# EAGLE design Register (EAGLE 9.6.2)
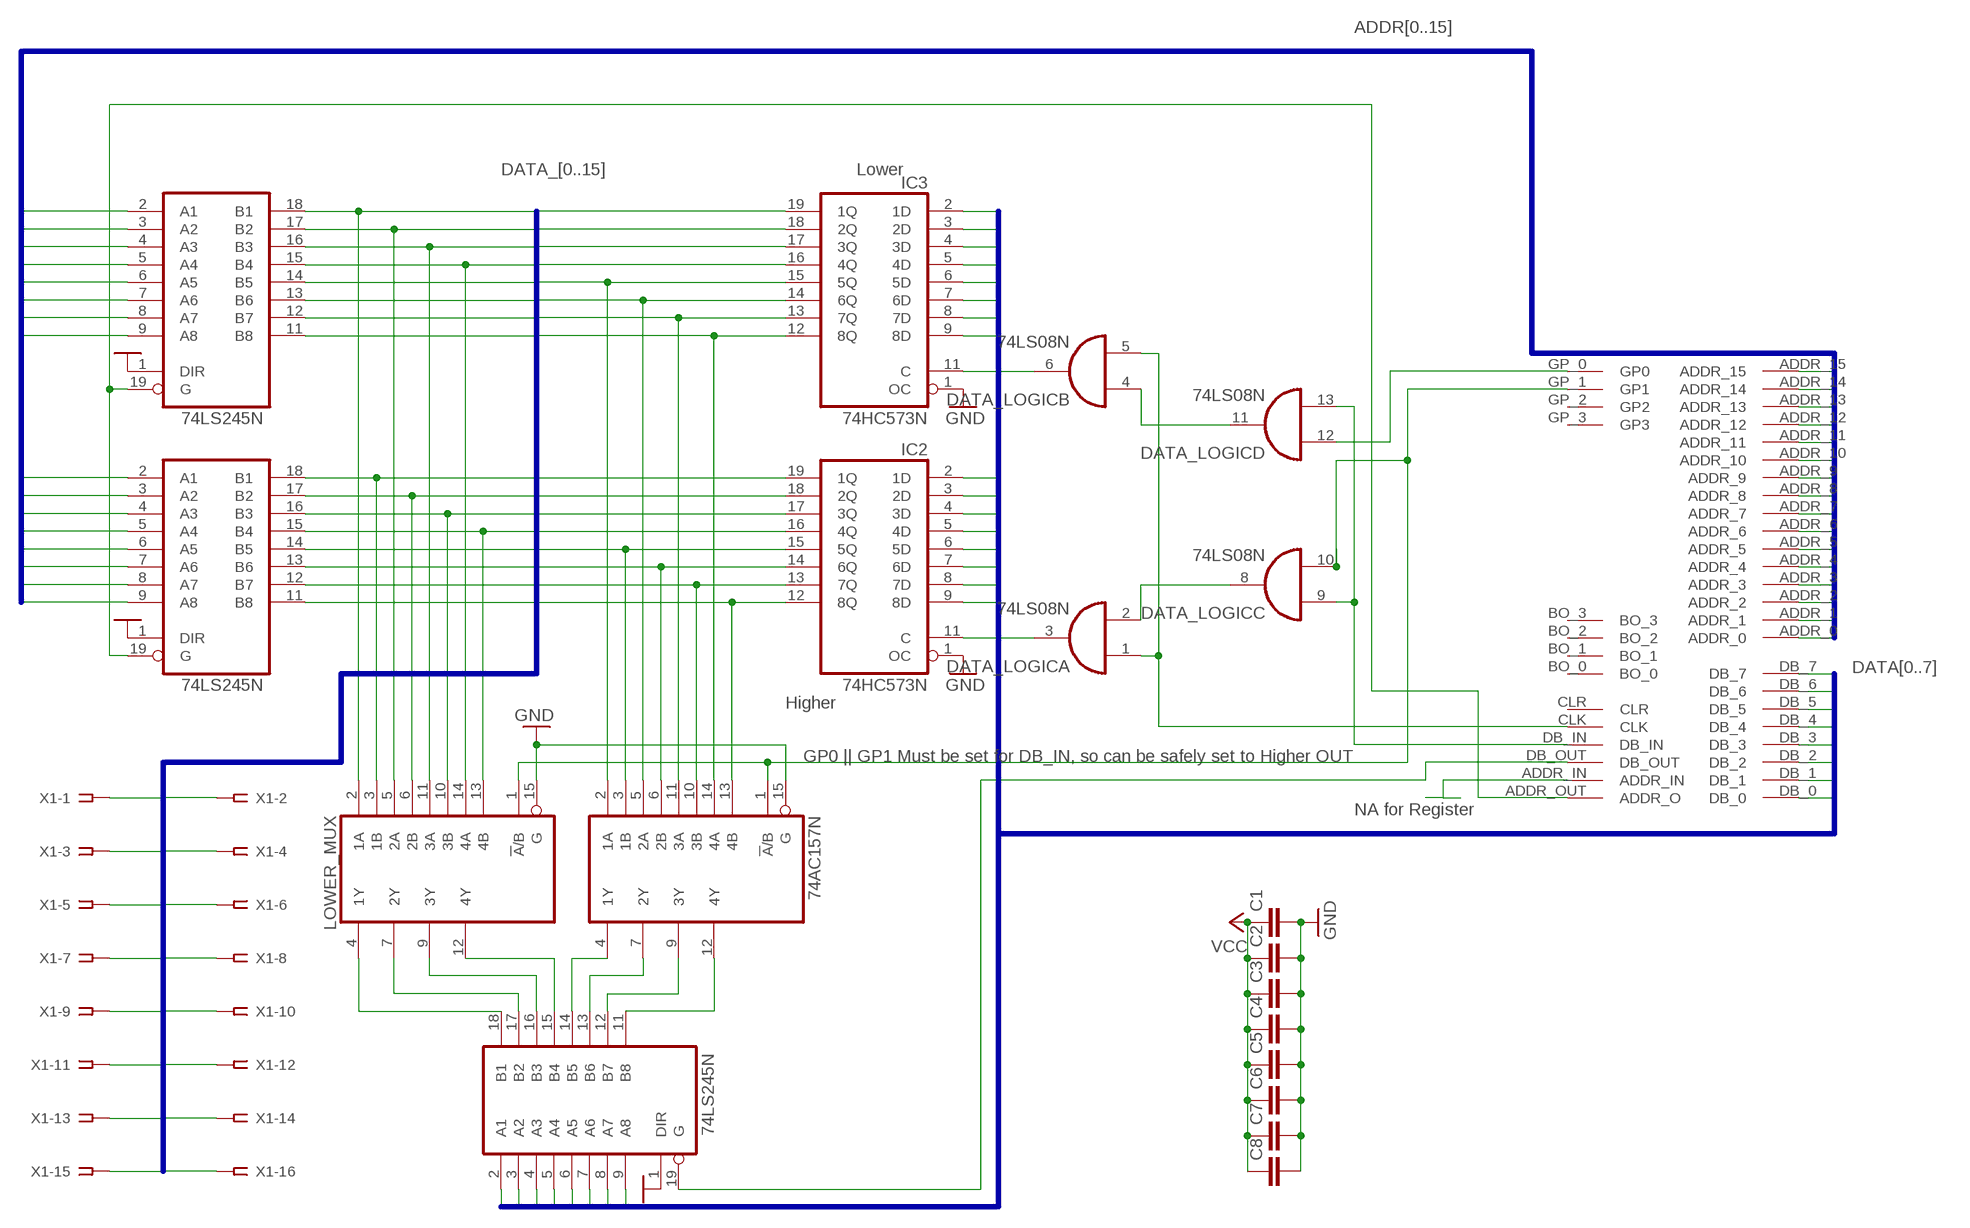
[diagram p0: schematic, sheet 1]

## Parts
ADDR_HIGHER_BUFFER  74LS245N  [DIL20]
ADDR_LOWER_BUFFER  74LS245N  [DIL20]
C1  C2.5/2  [C2.5-2]
C2  C2.5/2  [C2.5-2]
C3  C2.5/2  [C2.5-2]
C4  C2.5/2  [C2.5-2]
C5  C2.5/2  [C2.5-2]
C6  C2.5/2  [C2.5-2]
C7  C2.5/2  [C2.5-2]
C8  C2.5/2  [C2.5-2]
DATA_LOGIC  74LS08N  [DIL14]
DATA_OUTPUT_BUFFER  74LS245N  [DIL20]
HIGHER_MUX  74AC157N  [DIL16]
IC2  74HC573N  [DIL20]
IC3  74HC573N  [DIL20]
LOWER_MUX  74AC157N  [DIL16]
U$1  BACKPLATE_INTERFACEEDGE_FINGER  [BACK_INTERFACE-FOOT]
X1  SSW-108-02-G-D  [SSW-108-02-G-D]

## Nets
ADDR0: ADDR_LOWER_BUFFER.2(A1) U$1.ADDR_0
ADDR1: ADDR_LOWER_BUFFER.3(A2) U$1.ADDR_1
ADDR2: ADDR_LOWER_BUFFER.4(A3) U$1.ADDR_2
ADDR3: ADDR_LOWER_BUFFER.5(A4) U$1.ADDR_3
ADDR4: ADDR_LOWER_BUFFER.6(A5) U$1.ADDR_4
ADDR5: ADDR_LOWER_BUFFER.7(A6) U$1.ADDR_5
ADDR6: ADDR_LOWER_BUFFER.8(A7) U$1.ADDR_6
ADDR7: ADDR_LOWER_BUFFER.9(A8) U$1.ADDR_7
ADDR8: ADDR_HIGHER_BUFFER.2(A1) U$1.ADDR_8
ADDR9: ADDR_HIGHER_BUFFER.3(A2) U$1.ADDR_9
ADDR10: ADDR_HIGHER_BUFFER.4(A3) U$1.ADDR_10
ADDR11: ADDR_HIGHER_BUFFER.5(A4) U$1.ADDR_11
ADDR12: ADDR_HIGHER_BUFFER.6(A5) U$1.ADDR_12
ADDR13: ADDR_HIGHER_BUFFER.7(A6) U$1.ADDR_13
ADDR14: ADDR_HIGHER_BUFFER.8(A7) U$1.ADDR_14
ADDR15: ADDR_HIGHER_BUFFER.9(A8) U$1.ADDR_15
CLK: DATA_LOGIC.1(A:I0) DATA_LOGIC.5(B:I1) U$1.CLK
CTRL_ADDR_OUT: ADDR_HIGHER_BUFFER.19(G) ADDR_LOWER_BUFFER.19(G) U$1.ADDR_OUT(ADDR_O)
CTRL_DB_IN: DATA_LOGIC.9(C:I0) DATA_LOGIC.13(D:I1) U$1.DB_IN
CTRL_DB_OUT: DATA_OUTPUT_BUFFER.19(G) U$1.DB_OUT
DATA0: DATA_OUTPUT_BUFFER.2(A1) IC2.2(1D) IC3.2(1D) U$1.DB_0
DATA1: DATA_OUTPUT_BUFFER.3(A2) IC2.3(2D) IC3.3(2D) U$1.DB_1
DATA2: DATA_OUTPUT_BUFFER.4(A3) IC2.4(3D) IC3.4(3D) U$1.DB_2
DATA3: DATA_OUTPUT_BUFFER.5(A4) IC2.5(4D) IC3.5(4D) U$1.DB_3
DATA4: DATA_OUTPUT_BUFFER.6(A5) IC2.6(5D) IC3.6(5D) U$1.DB_4
DATA5: DATA_OUTPUT_BUFFER.7(A6) IC2.7(6D) IC3.7(6D) U$1.DB_5
DATA6: DATA_OUTPUT_BUFFER.8(A7) IC2.8(7D) IC3.8(7D) U$1.DB_6
DATA7: DATA_OUTPUT_BUFFER.9(A8) IC2.9(8D) IC3.9(8D) U$1.DB_7
DATA_0: ADDR_LOWER_BUFFER.18(B1) IC3.19(1Q) LOWER_MUX.2(1A) X1.15
DATA_1: ADDR_LOWER_BUFFER.17(B2) IC3.18(2Q) LOWER_MUX.5(2A) X1.13
DATA_2: ADDR_LOWER_BUFFER.16(B3) IC3.17(3Q) LOWER_MUX.11(3A) X1.11
DATA_3: ADDR_LOWER_BUFFER.15(B4) IC3.16(4Q) LOWER_MUX.14(4A) X1.9
DATA_4: ADDR_LOWER_BUFFER.14(B5) HIGHER_MUX.2(1A) IC3.15(5Q) X1.7
DATA_5: ADDR_LOWER_BUFFER.13(B6) HIGHER_MUX.5(2A) IC3.14(6Q) X1.5
DATA_6: ADDR_LOWER_BUFFER.12(B7) HIGHER_MUX.11(3A) IC3.13(7Q) X1.3
DATA_7: ADDR_LOWER_BUFFER.11(B8) HIGHER_MUX.14(4A) IC3.12(8Q) X1.1
DATA_8: ADDR_HIGHER_BUFFER.18(B1) IC2.19(1Q) LOWER_MUX.3(1B) X1.2
DATA_9: ADDR_HIGHER_BUFFER.17(B2) IC2.18(2Q) LOWER_MUX.6(2B) X1.4
DATA_10: ADDR_HIGHER_BUFFER.16(B3) IC2.17(3Q) LOWER_MUX.10(3B) X1.6
DATA_11: ADDR_HIGHER_BUFFER.15(B4) IC2.16(4Q) LOWER_MUX.13(4B) X1.8
DATA_12: ADDR_HIGHER_BUFFER.14(B5) HIGHER_MUX.3(1B) IC2.15(5Q) X1.10
DATA_13: ADDR_HIGHER_BUFFER.13(B6) HIGHER_MUX.6(2B) IC2.14(6Q) X1.12
DATA_14: ADDR_HIGHER_BUFFER.12(B7) HIGHER_MUX.10(3B) IC2.13(7Q) X1.14
DATA_15: ADDR_HIGHER_BUFFER.11(B8) HIGHER_MUX.13(4B) IC2.12(8Q) X1.16
GND: ADDR_HIGHER_BUFFER.1(DIR) ADDR_LOWER_BUFFER.1(DIR) C1.2 C2.2 C3.2 C4.2 C5.2 C6.2 C7.2 C8.2 DATA_OUTPUT_BUFFER.1(DIR) HIGHER_MUX.15(G) IC2.1(OC) IC3.1(OC) LOWER_MUX.15(G)
GP_0: DATA_LOGIC.12(D:I0) U$1.GP_0(GP0)
GP_1: DATA_LOGIC.10(C:I1) HIGHER_MUX.1(!A!/B) LOWER_MUX.1(!A!/B) U$1.GP_1(GP1)
N$2: DATA_OUTPUT_BUFFER.18(B1) LOWER_MUX.4(1Y)
N$3: DATA_OUTPUT_BUFFER.17(B2) LOWER_MUX.7(2Y)
N$4: DATA_LOGIC.6(B:O) IC3.11(C)
N$5: DATA_LOGIC.3(A:O) IC2.11(C)
N$6: DATA_LOGIC.4(B:I0) DATA_LOGIC.11(D:O)
N$7: DATA_LOGIC.2(A:I1) DATA_LOGIC.8(C:O)
N$24: DATA_OUTPUT_BUFFER.16(B3) LOWER_MUX.9(3Y)
N$26: DATA_OUTPUT_BUFFER.15(B4) LOWER_MUX.12(4Y)
N$28: DATA_OUTPUT_BUFFER.14(B5) HIGHER_MUX.4(1Y)
N$29: U$1.ADDR_IN
N$30: DATA_OUTPUT_BUFFER.13(B6) HIGHER_MUX.7(2Y)
N$31: DATA_OUTPUT_BUFFER.12(B7) HIGHER_MUX.9(3Y)
N$32: DATA_OUTPUT_BUFFER.11(B8) HIGHER_MUX.12(4Y)
VCC: C1.1 C2.1 C3.1 C4.1 C5.1 C6.1 C7.1 C8.1
Unconnected: U$1.BO_0 U$1.BO_1 U$1.BO_2 U$1.BO_3 U$1.CLR U$1.GP_2(GP2) U$1.GP_3(GP3) U$1.NC_0 U$1.NC_1 U$1.NC_2 U$1.NC_3 U$1.NC_4 U$1.NC_5 U$1.NC_6 U$1.NC_7 U$1.NC_8 U$1.NC_9 U$1.NC_10 U$1.NC_11 U$1.NC_12 U$1.NC_13 U$1.NC_14 U$1.NC_15 U$1.NC_16 U$1.NC_17 U$1.NC_18 U$1.NC_19 U$1.NC_20 U$1.NC_21

## Buses
DATA[0..7]
ADDR[0..15]
DATA_[0..15]

## Notes on the sheet
- Lower
- Higher
- GP0 || GP1 Must be set for DB_IN, so can be safely set to Higher OUT
- NA for Register

## Power pins joined to a net without a drawn wire
GND: ADDR_HIGHER_BUFFER.10(GND) ADDR_LOWER_BUFFER.10(GND) DATA_LOGIC.7(P:GND) DATA_OUTPUT_BUFFER.10(GND) HIGHER_MUX.8(GND) IC2.10(GND) IC3.10(GND) LOWER_MUX.8(GND) U$1.GND_0(GND) U$1.GND_1(GND)
VCC: ADDR_HIGHER_BUFFER.20(VCC) ADDR_LOWER_BUFFER.20(VCC) DATA_LOGIC.14(P:VCC) DATA_OUTPUT_BUFFER.20(VCC) HIGHER_MUX.16(VCC) IC2.20(VCC) IC3.20(VCC) LOWER_MUX.16(VCC) U$1.VCC_0(VCC) U$1.VCC_1(VCC)

## Library data of the parts
ADDR_HIGHER_BUFFER ADDR_LOWER_BUFFER DATA_OUTPUT_BUFFER = 74xx-eu:74*245: Octal BUS TRANSCEIVER, 3-state
C1-C8 = capacitor-wima:C: CAPACITOR naming: grid - package width
DATA_LOGIC = 74xx-eu:74*08: Quad 2-input AND gate
HIGHER_MUX LOWER_MUX = 74xx-eu:74*157: Quadruple 2-line to 1-line data SELECTOR/MULTIPLEXER
IC2 IC3 = 74xx-eu:74*573: 8-bit D latch BUS DRIVER
U$1 = Computer:BACKPLATE_INTERFACE
X1 = con-samtec:SSW-108-02-G: THROUGH-HOLE .025" SQ POST SOCKET Source: Samtec SSW.pdf; MF: Samtec Inc.; MPN: SSW-108-02-G-D; OC_FARNELL: unknown; OC_NEWARK: 85K7646

## Board
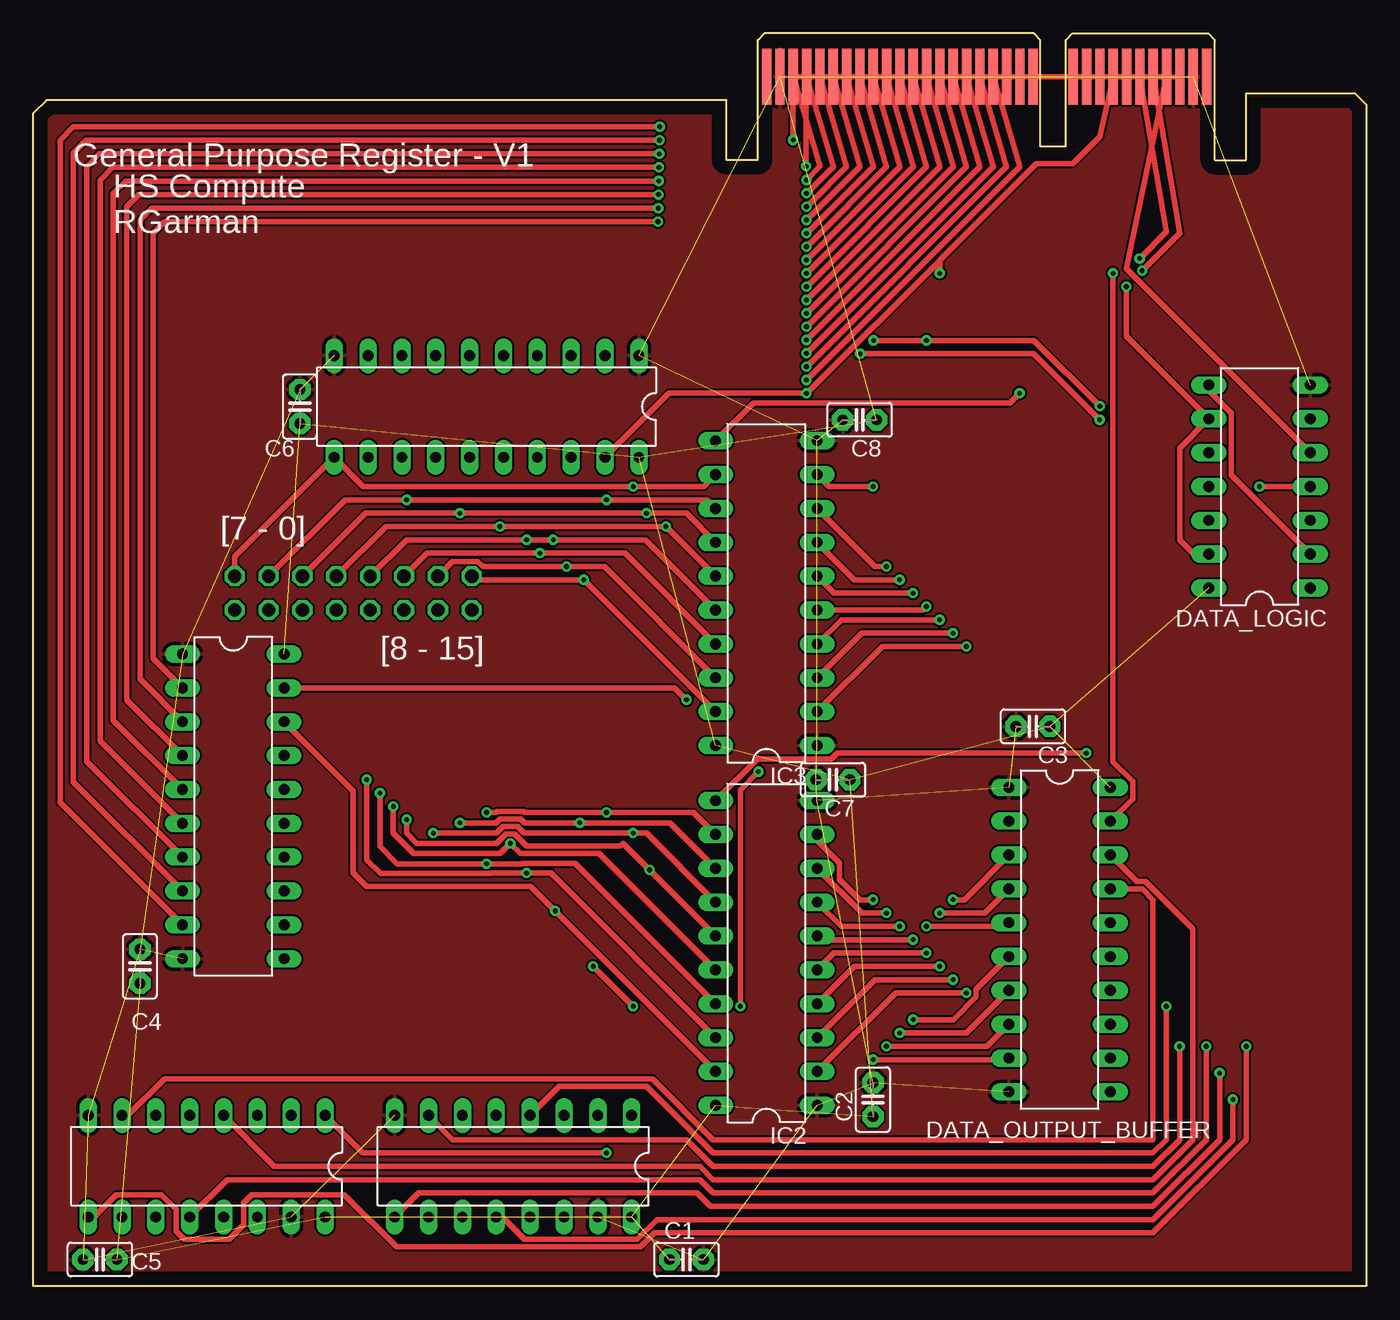
[diagram p1: board, top side]
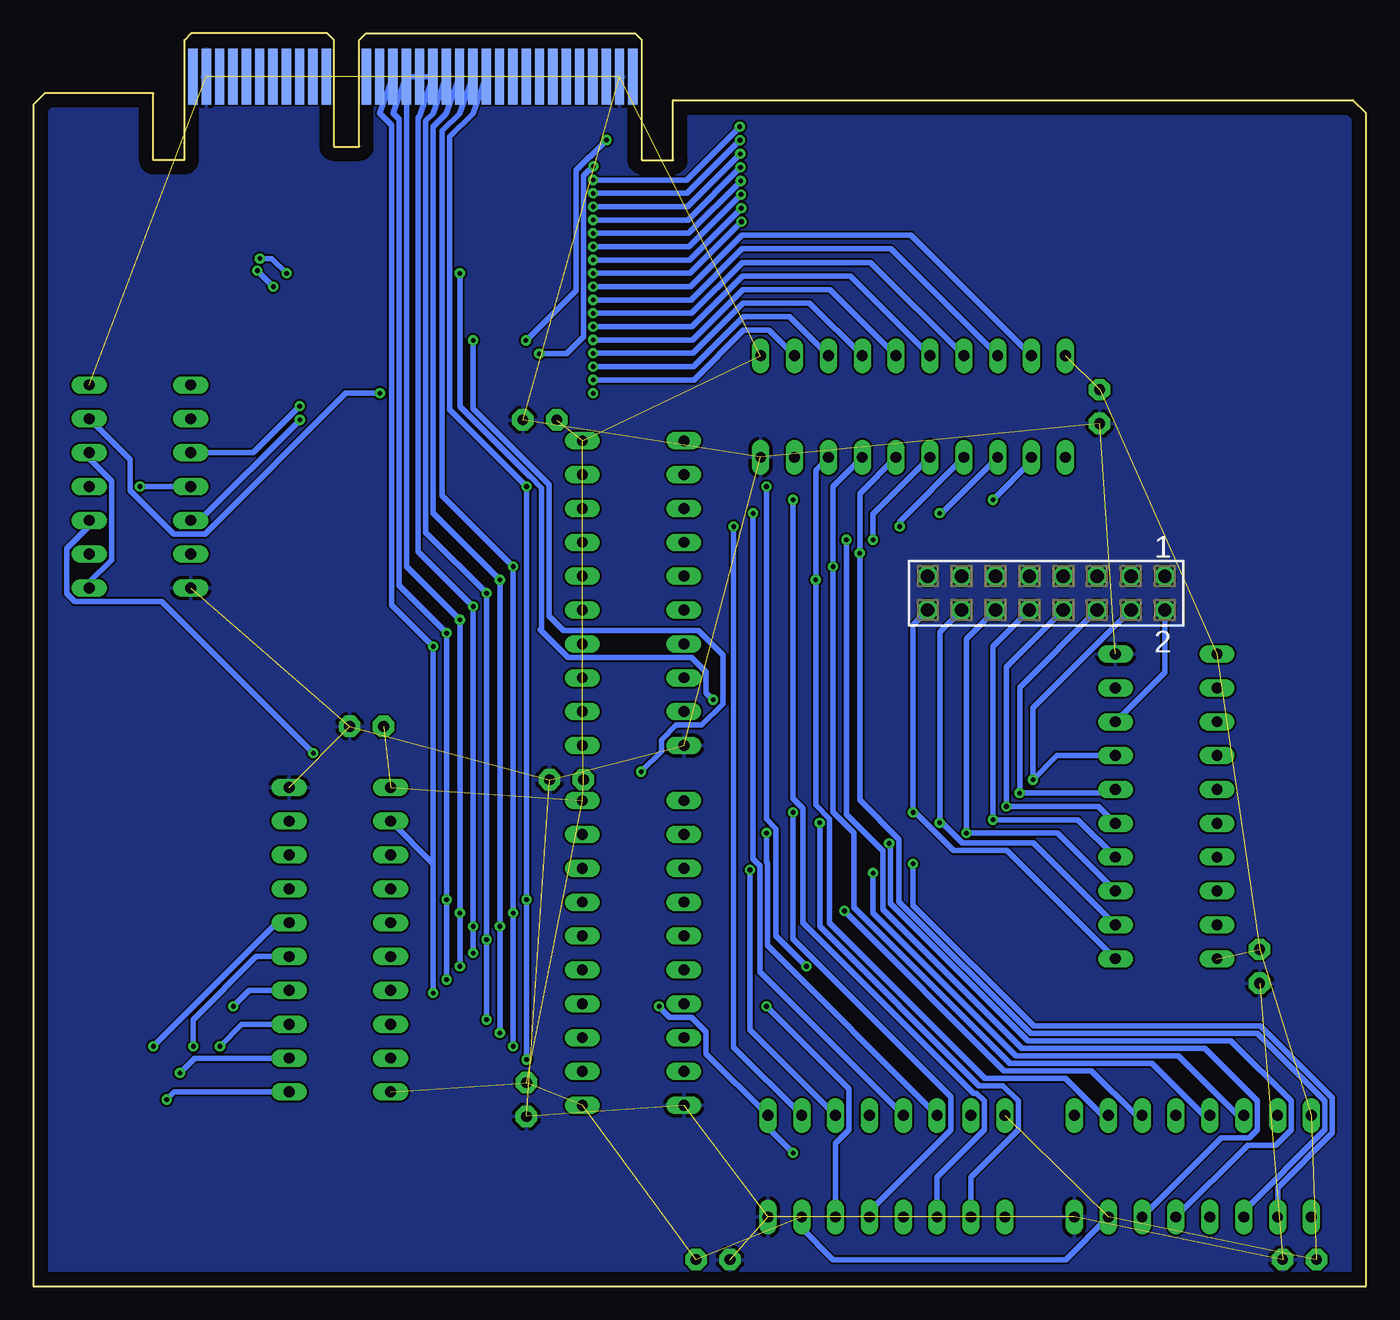
[diagram p2: board, bottom side, seen from below]

Size 100 x 94 mm. Coordinates in mm from the lower left corner, seen from the top.
Outline: 0,0 0,88 1,89 52,89 52,84.5 54.35,84.5 54.35,93.5 54.85,94 75.05,94 75.55,93.5 75.55,85.5 77.45,85.5 77.45,93.5 77.95,94 88.15,94 88.65,93.5 88.65,84.5 91,84.5 91,89.5 99.15,89.5 100,88.65 100,0 0,0
Copper layers (1*16): Top 0.035mm / dielectric 1.5mm / Bottom 0.035mm
Design rules "default *": minimum track width 16mil, minimum drill 0.35mm, track to track 6mil, track to pad 6mil, pad to pad 6mil, via to via 6mil, smd to smd 6mil, copper to edge 40mil, drill to drill 6mil, minimum pad ring 10mil, minimum via ring 8mil, stop-mask expansion 4mil, vias tented up to drill 0mil, thermal gap 10mil

### Footprints (pad centres in the part's own frame; a part is rotated, then mirrored left to right if it is on the bottom)
DIL20 = drill 0.813 long: 1 -11.43,-3.81; 2 -8.89,-3.81; 3 -6.35,-3.81; 4 -3.81,-3.81; 5 -1.27,-3.81; 6 1.27,-3.81; 7 3.81,-3.81; 8 6.35,-3.81; 9 8.89,-3.81; 10 11.43,-3.81; 11 11.43,3.81; 12 8.89,3.81; 13 6.35,3.81; 14 3.81,3.81; 15 1.27,3.81; 16 -1.27,3.81; 17 -3.81,3.81; 18 -6.35,3.81; 19 -8.89,3.81; 20 -11.43,3.81
C2.5-2 = drill 0.813 pad 1.6 octagon: 1 -1.27,0; 2 1.27,0
DIL14 = drill 0.813 long: 1 -7.62,-3.81; 2 -5.08,-3.81; 3 -2.54,-3.81; 4 0,-3.81; 5 2.54,-3.81; 6 5.08,-3.81; 7 7.62,-3.81; 8 7.62,3.81; 9 5.08,3.81; 10 2.54,3.81; 11 0,3.81; 12 -2.54,3.81; 13 -5.08,3.81; 14 -7.62,3.81
DIL16 = drill 0.813 long: 1 -8.89,-3.81; 2 -6.35,-3.81; 3 -3.81,-3.81; 4 -1.27,-3.81; 5 1.27,-3.81; 6 3.81,-3.81; 7 6.35,-3.81; 8 8.89,-3.81; 9 8.89,3.81; 10 6.35,3.81; 11 3.81,3.81; 12 1.27,3.81; 13 -1.27,3.81; 14 -3.81,3.81; 15 -6.35,3.81; 16 -8.89,3.81
BACK_INTERFACE-FOOT = smd 0.7 x 4.2: ADDR_0 17.02,0; ADDR_1 16.02,0; ADDR_2 15.02,0; ADDR_3 14.02,0; ADDR_4 13.02,0; ADDR_5 12.02,0; ADDR_6 11.02,0; ADDR_7 10.02,0; ADDR_8 9.02,0; ADDR_9 8.02,0; ADDR_10 7.02,0; ADDR_11 6.02,0; ADDR_12 5.02,0; ADDR_13 4.02,0; ADDR_14 3.02,0; ADDR_15 2.02,0; ADDR_IN 27.02,0; ADDR_OUT 26.02,0; CLK 30.02,0; CLR 31.02,0; DB_IN 29.02,0; DB_OUT 28.02,0; GND_0 32.02,0; GND_1 1.02,0; NC_0 33.02,0; NC_1 25.02,0; NC_2 24.02,0; NC_3 23.02,0; NC_4 20.02,0; NC_5 19.02,0; NC_6 18.02,0; NC_7 0.02,0 | smd 0.7 x 4.2 bottom: BO_0 27.02,0; BO_1 26.02,0; BO_2 25.02,0; BO_3 24.02,0; DB_0 18.02,0; DB_1 17.02,0; DB_2 16.02,0; DB_3 15.02,0; DB_4 14.02,0; DB_5 13.02,0; DB_6 12.02,0; DB_7 11.02,0; GP_0 31.02,0; GP_1 30.02,0; GP_2 29.02,0; GP_3 28.02,0; NC_8 33.02,0; NC_9 23.02,0; NC_10 20.02,0; NC_11 19.02,0; NC_12 10.02,0; NC_13 9.02,0; NC_14 8.02,0; NC_15 7.02,0; NC_16 6.02,0; NC_17 5.02,0; NC_18 4.02,0; NC_19 3.02,0; NC_20 2.02,0; NC_21 0.02,0; VCC_0 32.02,0; VCC_1 1.02,0
SSW-108-02-G-D = drill 1 pad 1.5 octagon: 1 -8.89,-1.27; 2 -8.89,1.27; 3 -6.35,-1.27; 4 -6.35,1.27; 5 -3.81,-1.27; 6 -3.81,1.27; 7 -1.27,-1.27; 8 -1.27,1.27; 9 1.27,-1.27; 10 1.27,1.27; 11 3.81,-1.27; 12 3.81,1.27; 13 6.35,-1.27; 14 6.35,1.27; 15 8.89,-1.27; 16 8.89,1.27

### Placement (x,y rotation side)
ADDR_HIGHER_BUFFER  15,36 270 top
ADDR_LOWER_BUFFER  34,66 180 top
C1  49,2 0 top
C2  63,14 90 top
C3  75,42 180 top
C4  8,24 90 top
C5  5,2 180 top
C6  20,66 90 top
C7  60,38 180 top
C8  62,65 180 top
DATA_LOGIC  92,60 90 top
DATA_OUTPUT_BUFFER  77,26 270 top
HIGHER_MUX  36,9 180 top
IC2  55,25 90 top
IC3  55,52 90 top
LOWER_MUX  13,9 180 top
U$1  55,90.75 0 top
X1  24,52 180 bottom

### Tracks (layer width: path | path; a pad name or v marks a point on that pad's centre or on a via)
ADDR0  (via drill 0.35)
  Top 0.406: v58,68 58.27,68.27 58.3,68.27 74.02,83.98 U$1.ADDR_0
  Bottom 0.406: v58,68 50.43,68 46.72,71.72 44.8,71.72 ADDR_LOWER_BUFFER.2
ADDR1  (via drill 0.35)
  Top 0.406: v58,69 58.27,69.27 58.3,69.27 73.02,83.98 U$1.ADDR_1
  Bottom 0.406: v58,69 50.47,69 46.74,72.74 43.28,72.74 ADDR_LOWER_BUFFER.3
ADDR2  (via drill 0.35)
  Top 0.406: v58,70 58.27,70.27 58.3,70.27 72.02,83.98 U$1.ADDR_2
  Bottom 0.406: v58,70 50.51,70 46.76,73.75 41.76,73.75 ADDR_LOWER_BUFFER.4
ADDR3  (via drill 0.35)
  Top 0.406: v58,71 58.27,71.27 58.3,71.27 71.02,83.98 U$1.ADDR_3
  Bottom 0.406: v58,71 50.55,71 46.77,74.77 40.23,74.77 ADDR_LOWER_BUFFER.5
ADDR4  (via drill 0.35)
  Top 0.406: v58,72 58.27,72.27 58.3,72.27 70.02,83.98 U$1.ADDR_4
  Bottom 0.406: v58,72 50.59,72 46.79,75.79 38.71,75.79 ADDR_LOWER_BUFFER.6
ADDR5  (via drill 0.35)
  Top 0.406: v58,73 58.27,73.27 58.3,73.27 69.02,83.98 U$1.ADDR_5
  Bottom 0.406: v58,73 50.62,73 46.81,76.81 37.19,76.81 ADDR_LOWER_BUFFER.7
ADDR6  (via drill 0.35)
  Top 0.406: v58,74 58.27,74.27 58.3,74.27 68.02,83.98 U$1.ADDR_6
  Bottom 0.406: v58,74 50.66,74 46.83,77.83 35.67,77.83 ADDR_LOWER_BUFFER.8
ADDR7  (via drill 0.35)
  Top 0.406: v58,75 58.27,75.27 58.3,75.27 67.02,83.98 U$1.ADDR_7
  Bottom 0.406: v58,75 50.7,75 46.85,78.85 34.15,78.85 ADDR_LOWER_BUFFER.9
ADDR8  (via drill 0.35)
  Top 0.406: v58,76 58.27,76.27 58.3,76.27 66.02,83.98 U$1.ADDR_8 | v46.87,79.87 9.87,79.87 9,79 9,47.08 ADDR_HIGHER_BUFFER.2
  Bottom 0.406: v58,76 50.74,76 v46.87,79.87
ADDR9  (via drill 0.35)
  Top 0.406: v58,77 58.27,77.27 58.3,77.27 65.02,83.98 U$1.ADDR_9 | v46.89,80.89 8.89,80.89 8,80 8,45.54 ADDR_HIGHER_BUFFER.3
  Bottom 0.406: v58,77 50.77,77 v46.89,80.89
ADDR10  (via drill 0.35)
  Top 0.406: v58,78 58.27,78.27 58.3,78.27 64.02,83.98 U$1.ADDR_10 | v46.91,81.91 7.91,81.91 7,81 7,44 ADDR_HIGHER_BUFFER.4
  Bottom 0.406: v58,78 50.81,78 v46.91,81.91
ADDR11  (via drill 0.35)
  Top 0.406: v58,79 58.27,79.27 58.3,79.27 63.02,83.98 U$1.ADDR_11 | v46.92,82.92 6.92,82.92 6,82 6,42.46 ADDR_HIGHER_BUFFER.5
  Bottom 0.406: v58,79 50.85,79 v46.92,82.92
ADDR12  (via drill 0.35)
  Top 0.406: v58,80 58.27,80.27 58.3,80.27 62.02,83.98 U$1.ADDR_12 | v46.94,83.94 5.94,83.94 5,83 5,40.92 ADDR_HIGHER_BUFFER.6
  Bottom 0.406: v58,80 50.89,80 v46.94,83.94
ADDR13  (via drill 0.35)
  Top 0.406: v58,81 58.27,81.27 58.3,81.27 61.02,83.98 U$1.ADDR_13 | v46.96,84.96 4.96,84.96 4,84 4,39.38 ADDR_HIGHER_BUFFER.7
  Bottom 0.406: v58,81 50.92,81 v46.96,84.96
ADDR14  (via drill 0.35)
  Top 0.406: v58,82 58.27,82.27 58.3,82.27 60.02,83.98 U$1.ADDR_14 | v46.98,85.98 3.98,85.98 3,85 3,37.84 ADDR_HIGHER_BUFFER.8
  Bottom 0.406: v58,82 50.96,82 v46.98,85.98
ADDR15  (via drill 0.35)
  Top 0.406: U$1.ADDR_15 59.02,84.02 v58,83 | v47,87 3,87 2,86 2,36.3 ADDR_HIGHER_BUFFER.9
  Bottom 0.406: v58,83 51,83 v47,87
CLK
  Top 0.406: DATA_LOGIC.5 82.02,76.33 U$1.CLK
  Bottom 0.406: DATA_LOGIC.1 95.81,52.82 94.13,54.5 94.13,60.42 95.81,62.1 DATA_LOGIC.5
CTRL_ADDR_OUT  (via drill 0.35)
  Top 0.406: ADDR_HIGHER_BUFFER.19 48.11,44.89 v49,44 | U$1.ADDR_OUT 80.02,86.24 77.99,84.2 75.24,84.2 68.02,76.98 68,76.96 | 68,76.96 58.3,67.27 58.27,67.27 v58,67 47.7,67 ADDR_LOWER_BUFFER.19 | v68,76 68,76.96
  Bottom 0.406: v49,44 49.51,44.51 49.51,46.07 50.62,47.17 59.89,47.17 61.86,49.14 | 61.86,49.14 62,49.28 | 61.86,49.14 61.86,59.9 62.7,60.73 62.73,60.73 68,66 v68,76
CTRL_DB_IN  (via drill 0.35)
  Top 0.406: DATA_LOGIC.13 87.08,54.92 86,56 86,62.89 DATA_LOGIC.9 82,71.27 v82,75 | v83.19,76.19 86.02,79.02 U$1.DB_IN
  Bottom 0.406: v82,75 v83.19,76.19
CTRL_DB_OUT  (via drill 0.35)
  Top 0.406: v81,76 81,39.34 82.49,37.85 82.49,36.57 DATA_OUTPUT_BUFFER.19 | v83,77.1 85.02,79.12 U$1.DB_OUT
  Bottom 0.406: v81,76 82.1,77.1 v83,77.1
DATA0  (via drill 0.35)
  Top 0.406: IC2.2 64.7,22 v70,22 | IC3.2 63.7,48 v70,48
  Bottom 0.406: U$1.DB_0 74.02,88.02 73.12,87.12 73.12,51.12 v70,48 70,31.7 | 70,31.7 v70,22 | DATA_OUTPUT_BUFFER.2 70,31.7
DATA1  (via drill 0.35)
  Top 0.406: IC2.3 63.16,23 v69,23 | DATA_OUTPUT_BUFFER.3 69.84,29 v69,29 | IC3.3 62.16,49 v69,49
  Bottom 0.406: U$1.DB_1 73.02,88.02 72.56,87.56 72.56,52.56 v69,49 v69,29 v69,23
DATA2  (via drill 0.35)
  Top 0.406: IC2.4 61.62,24 v68,24 | DATA_OUTPUT_BUFFER.4 71.38,28 v68,28 | IC3.4 60.62,50 v68,50
  Bottom 0.406: U$1.DB_2 72,90.73 72,54 v68,50 v68,28 v68,24
DATA3  (via drill 0.35)
  Top 0.406: IC2.5 60.08,25 v67,25 | DATA_OUTPUT_BUFFER.5 72.92,27 v67,27 | IC3.5 66.73,50.73 v67,51
  Bottom 0.406: 71,90.73 U$1.DB_3 71.02,87.77 71.12,87.67 71.12,55.12 v67,51 v67,27 v67,25
DATA4  (via drill 0.35)
  Top 0.406: IC2.6 59.08,26 v66,26 | DATA_OUTPUT_BUFFER.6 70.73,22.27 70.73,21.7 69.04,20 v66,20 | IC3.6 60.08,52 v66,52
  Bottom 0.406: U$1.DB_4 70.02,87.98 70.56,87.44 70.56,56.56 v66,52 v66,26 v66,20
DATA5  (via drill 0.35)
  Top 0.406: IC2.7 60.62,27 v65,27 | DATA_OUTPUT_BUFFER.7 70,19 v65,19 | IC3.7 61.62,53 v65,53
  Bottom 0.406: U$1.DB_5 69.02,87.98 70,87 70,81 70,80.66 70,58 v65,53 v65,27 v65,19
DATA6  (via drill 0.35)
  Top 0.406: IC2.8 62.16,28 v64,28 | DATA_OUTPUT_BUFFER.8 71.54,18 v64,18 | IC3.8 63.16,54 v64,54
  Bottom 0.406: U$1.DB_6 68.02,87.98 69.32,86.68 69.32,59.32 v64,54 v64,28 v64,18
DATA7  (via drill 0.35)
  Top 0.406: IC2.9 58.81,33.45 60.49,31.77 60.49,30.51 62,29 v63,29 | DATA_OUTPUT_BUFFER.9 73.08,17 v63,17 | IC3.9 59.7,60 v63,60
  Bottom 0.406: U$1.DB_7 67.02,87.98 68.77,86.23 68.77,65.77 v63,60 v63,29 v63,17
DATA_0  (via drill 0.35)
  Top 0.406: IC3.19 v41.3,53 33.16,53 X1.15
  Bottom 0.406: LOWER_MUX.2 19.79,12.81 22.59,15.6 28.6,15.6 40.27,27.27 40.27,35.07 41.3,36.11 v41.3,53 41.3,61.24 ADDR_LOWER_BUFFER.18
DATA_1  (via drill 0.35)
  Top 0.406: IC3.18 42.84,54 v40,54 33.73,54 33.35,54.38 31.46,54.38 X1.13
  Bottom 0.406: LOWER_MUX.5 12.17,12.81 16.08,16.72 26.72,16.72 38.42,28.42 38.42,34.01 40,35.6 v40,54 40,60 ADDR_LOWER_BUFFER.17
DATA_2  (via drill 0.35)
  Top 0.406: IC3.17 44.38,55 v38,55 29.54,55 X1.11
  Bottom 0.406: LOWER_MUX.11 9.19,5.63 3.09,11.73 3.09,13.89 8.16,18.96 25.17,18.96 35.05,28.84 35.05,33.52 38,36.46 v38,55 38,59.46 ADDR_LOWER_BUFFER.16
DATA_3  (via drill 0.35)
  Top 0.406: IC3.16 45.92,56 v39,56 v37,56 28,56 X1.9
  Bottom 0.406: LOWER_MUX.14 10.87,11.13 8.77,11.13 8.17,11.73 8.17,13.89 12.12,17.84 25.84,17.84 36.27,28.27 36.27,32.65 39,35.39 v39,56 | ADDR_LOWER_BUFFER.15 37,57.92 v37,56
DATA_4  (via drill 0.35)
  Top 0.406: IC3.15 v47.46,57 v35,57 26.46,57 X1.7
  Bottom 0.406: HIGHER_MUX.2 47.46,17.92 v47.46,57 | v35,57 35,57.38 ADDR_LOWER_BUFFER.14
DATA_5  (via drill 0.35)
  Top 0.406: IC3.14 49,58 v46,58 v32,58 24.92,58 X1.5
  Bottom 0.406: v46,58 46,32.04 45.5,31.53 45.5,23.58 HIGHER_MUX.5 | ADDR_LOWER_BUFFER.13 31.84,58 v32,58
DATA_6  (via drill 0.35)
  Top 0.406: IC3.13 50.54,59 v43,59 v28,59 23.38,59 X1.3
  Bottom 0.406: HIGHER_MUX.11 32.19,8.17 28.63,11.73 28.63,13.89 29.23,14.49 29.49,14.49 42.27,27.27 42.27,35.84 43,36.58 v43,59 | ADDR_LOWER_BUFFER.12 25.11,61.89 v28,59
DATA_7  (via drill 0.35)
  Top 0.406: IC3.12 50.3,60 v45,60 24.76,60 ADDR_LOWER_BUFFER.11 15.11,54.73 X1.1 | v45,21 v42,24
  Bottom 0.406: HIGHER_MUX.14 39.81,10.71 38.79,11.73 38.79,14.79 v45,21 | v45,60 45,35.04 44.27,34.3 44.27,26.27 v42,24
DATA_8  (via drill 0.35)
  Top 0.406: IC2.19 v39.15,28.15 37.3,30 25,30 24,31 24,37.16 ADDR_HIGHER_BUFFER.18
  Bottom 0.406: v39.15,28.15 27.16,16.16 20.61,16.16 17.25,12.81 LOWER_MUX.3 | X1.2 15.11,46.05 ADDR_HIGHER_BUFFER.18
DATA_9  (via drill 0.35)
  Top 0.406: IC2.18 38.84,31 v37,31 34.35,31 34.3,30.96 26.04,30.96 25,32 v25,38
  Bottom 0.406: ADDR_HIGHER_BUFFER.17 23.19,39.81 v25,38 25,43.38 X1.4 | LOWER_MUX.6 9.63,12.81 14.1,17.28 26.28,17.28 37,28 v37,31
DATA_10  (via drill 0.35)
  Top 0.406: v26,37 26,33 27.31,31.69 v34,31.69 36.65,31.69 36.7,31.73 40.65,31.73 IC2.17
  Bottom 0.406: ADDR_HIGHER_BUFFER.16 19.08,37 v26,37 26,44.92 X1.6 | LOWER_MUX.10 6.65,7.38 2.54,11.5 2.54,14.12 7.93,19.52 24.93,19.52 34,28.58 v34,31.69
DATA_11  (via drill 0.35)
  Top 0.406: IC2.16 42.46,32.46 36.54,32.46 v35.79,33.21 35.03,32.46 28.54,32.46 27,34 v27,36
  Bottom 0.406: ADDR_HIGHER_BUFFER.15 20.08,36 v27,36 27,46.46 X1.8 | LOWER_MUX.13 8.88,10.57 6.79,10.57 5.63,11.73 5.63,13.89 10.14,18.4 25.4,18.4 35.71,28.71 35.71,32.89 35.79,32.97 v35.79,33.21
DATA_12  (via drill 0.35)
  Top 0.406: IC2.15 v46.23,31.23 44.23,33.23 44.02,33.02 37.02,33.02 36.09,33.95 35.48,33.95 34.77,33.23 28.77,33.23 28,34 v28,35
  Bottom 0.406: ADDR_HIGHER_BUFFER.14 21.62,35 v28,35 28,48 X1.10 | HIGHER_MUX.3 46.23,19.23 v46.23,31.23
DATA_13  (via drill 0.35)
  Top 0.406: IC2.14 46,34 v45,34 36.83,34 36.32,34.51 35.25,34.51 34.75,34 v30,34
  Bottom 0.406: ADDR_HIGHER_BUFFER.13 23.16,34 v30,34 30,48.54 X1.12 | HIGHER_MUX.6 44.94,25.56 44.94,31.77 45,31.83 v45,34
DATA_14  (via drill 0.35)
  Top 0.406: IC2.13 47.77,34.77 v41,34.77 36.85,34.77 36.55,35.06 35.02,35.06 34.73,34.77 v32,34.77
  Bottom 0.406: ADDR_HIGHER_BUFFER.12 24.97,33.27 30.3,33.27 31.81,34.77 v32,34.77 32,49.08 X1.14 | HIGHER_MUX.10 29.65,8.17 26.09,11.73 26.09,13.89 27.25,15.04 29.05,15.04 41,27 v41,34.77
DATA_15  (via drill 0.35)
  Top 0.406: IC2.12 49.54,35.54 v43,35.54 36.87,35.54 36.78,35.62 34.79,35.62 34.7,35.54 v34,35.54
  Bottom 0.406: ADDR_HIGHER_BUFFER.11 26.95,32.71 30.98,32.71 33.81,35.54 v34,35.54 34,49.62 X1.16 | v43,35.54 43,26.04 31.17,14.21 31.17,11.73 37.27,5.63 HIGHER_MUX.13
GND  (23 unrouted)
  Bottom 0.406: HIGHER_MUX.15 42.35,4.35 40,2 22.54,2 LOWER_MUX.15
  pour Top: 0,88 1,89 52,89 52,84.5 54.35,84.5 54.35,93.5 54.85,94 75.05,94 75.55,93.5 75.55,85.5 77.45,85.5 77.45,93.5 77.95,94 88.15,94 88.65,93.5 88.65,84.5 91,84.5 91,89.5 99.15,89.5 100,88.65 100,0 0,0
GP_0  (via drill 0.35)  (1 unrouted)
  Top 0.406: v57.98,84.02 57.98,90.71 U$1.GP_0 | v62.04,69.96 75.04,69.96 v80,65
  Bottom 0.406: v57.98,84.02 58.27,83.73 58.3,83.73 58.73,83.3 58.73,71.23 60,69.96 v62.04,69.96 | v80,65 87.54,57.46 DATA_LOGIC.12
GP_1  (via drill 0.35)  (1 unrouted)
  Top 0.406: v57,86 57,90.73 U$1.GP_1 | LOWER_MUX.1 24.7,10 v43,10 | v53.04,21 53.04,37.24 v54.4,38.6 | v63.04,70.96 v67,70.96 75.08,70.96 v80.02,66.02
  Bottom 0.406: v57,86 58.25,84.75 58.28,84.75 59.29,83.75 59.29,74.71 v63.04,70.96 | v43,10 44.89,11.89 HIGHER_MUX.1 49.51,17.43 49.51,19.07 50.62,20.17 52.27,20.17 53.04,20.94 v53.04,21 | v54.4,38.6 52.87,40.13 52.87,40.99 51.76,42.09 49.87,42.09 48.27,43.7 48.27,47.36 50.11,49.21 60.21,49.21 61.3,50.3 61.3,60.13 67,65.83 v67,70.96 | v80.02,66.02 83.5,62.54 DATA_LOGIC.10
N$2
  Top 0.406: LOWER_MUX.4 18.08,9 50,9 51,8 84,8 87,11 87,26.79 83.42,30.37 82.79,30.37 DATA_OUTPUT_BUFFER.18
N$3
  Top 0.406: LOWER_MUX.7 7.09,12.81 9.84,15.56 46.44,15.56 51,11 84,11 84,29 83.19,29.81 DATA_OUTPUT_BUFFER.17
N$4  (via drill 0.35)
  Top 0.406: IC3.11 54.03,66.27 73.27,66.27 v74,67
  Bottom 0.406: DATA_LOGIC.6 92.73,62 92.73,59.7 89.48,56.44 87.11,56.44 76.55,67 v74,67
N$5  (via drill 0.35)
  Top 0.406: v79,40 60.34,40 59.89,39.55 54.31,39.55 IC2.11
  Bottom 0.406: DATA_LOGIC.3 95.81,57.02 97.49,55.34 97.49,51.96 96.89,51.36 90.36,51.36 v79,40
N$6  (via drill 0.35)
  Top 0.406: DATA_LOGIC.4 v92,60
  Bottom 0.406: v92,60 DATA_LOGIC.11
N$7
  Top 0.406: DATA_LOGIC.8 88.19,67.18 89.87,65.5 89.87,60.86 DATA_LOGIC.2
N$24  (via drill 0.35)
  Top 0.406: LOWER_MUX.9 4.55,5.19 6.23,6.87 9.61,6.87 10.71,5.76 10.71,4.11 11.31,3.51 14.69,3.51 15.79,4.62 15.79,6.27 16.39,6.87 23.34,6.87 27.25,2.96 45.54,2.96 46.59,4 84,4 91,11 v91,18
  Bottom 0.406: DATA_OUTPUT_BUFFER.16 81.73,27.27 v91,18
N$26  (via drill 0.35)
  Top 0.406: LOWER_MUX.12 14.54,8 50,8 51,7 84,7 88,11 v88,18
  Bottom 0.406: DATA_OUTPUT_BUFFER.15 83.27,24.73 88,20 v88,18
N$28  (via drill 0.35)
  Top 0.406: HIGHER_MUX.4 39.46,15 46,15 51,10 84,10 85,11 v85,21
  Bottom 0.406: DATA_OUTPUT_BUFFER.14 83.81,22.19 v85,21
N$30  (via drill 0.35)
  Top 0.406: HIGHER_MUX.7 31.46,11 49,11 51,9 84,9 86,11 v86,18
  Bottom 0.406: DATA_OUTPUT_BUFFER.13 84.35,19.65 v86,18
N$31  (via drill 0.35)
  Top 0.406: HIGHER_MUX.9 28.92,7 49.79,7 50.79,6 84,6 89,11 v89,16
  Bottom 0.406: DATA_OUTPUT_BUFFER.12 87.89,17.11 v89,16
N$32  (via drill 0.35)
  Top 0.406: HIGHER_MUX.12 35.17,5.19 36.85,3.51 45.31,3.51 46.8,5 84,5 90,11 v90,14
  Bottom 0.406: v90,14 89.43,14.57 DATA_OUTPUT_BUFFER.11
VCC  (17 unrouted)
  pour Bottom: 0,88 1,89 52,89 52,84.5 54.35,84.5 54.35,93.5 54.85,94 75.05,94 75.55,93.5 75.55,85.5 77.45,85.5 77.45,93.5 77.95,94 88.15,94 88.65,93.5 88.65,84.5 91,84.5 91,89.5 99.15,89.5 100,88.65 100,0 0,0

### Text on the board
tNames: General Purpose Register - V1 | HS Compute / RGarman | [7 - 0] | [8 - 15]